# EAGLE design Haar (EAGLE 9.2.1)
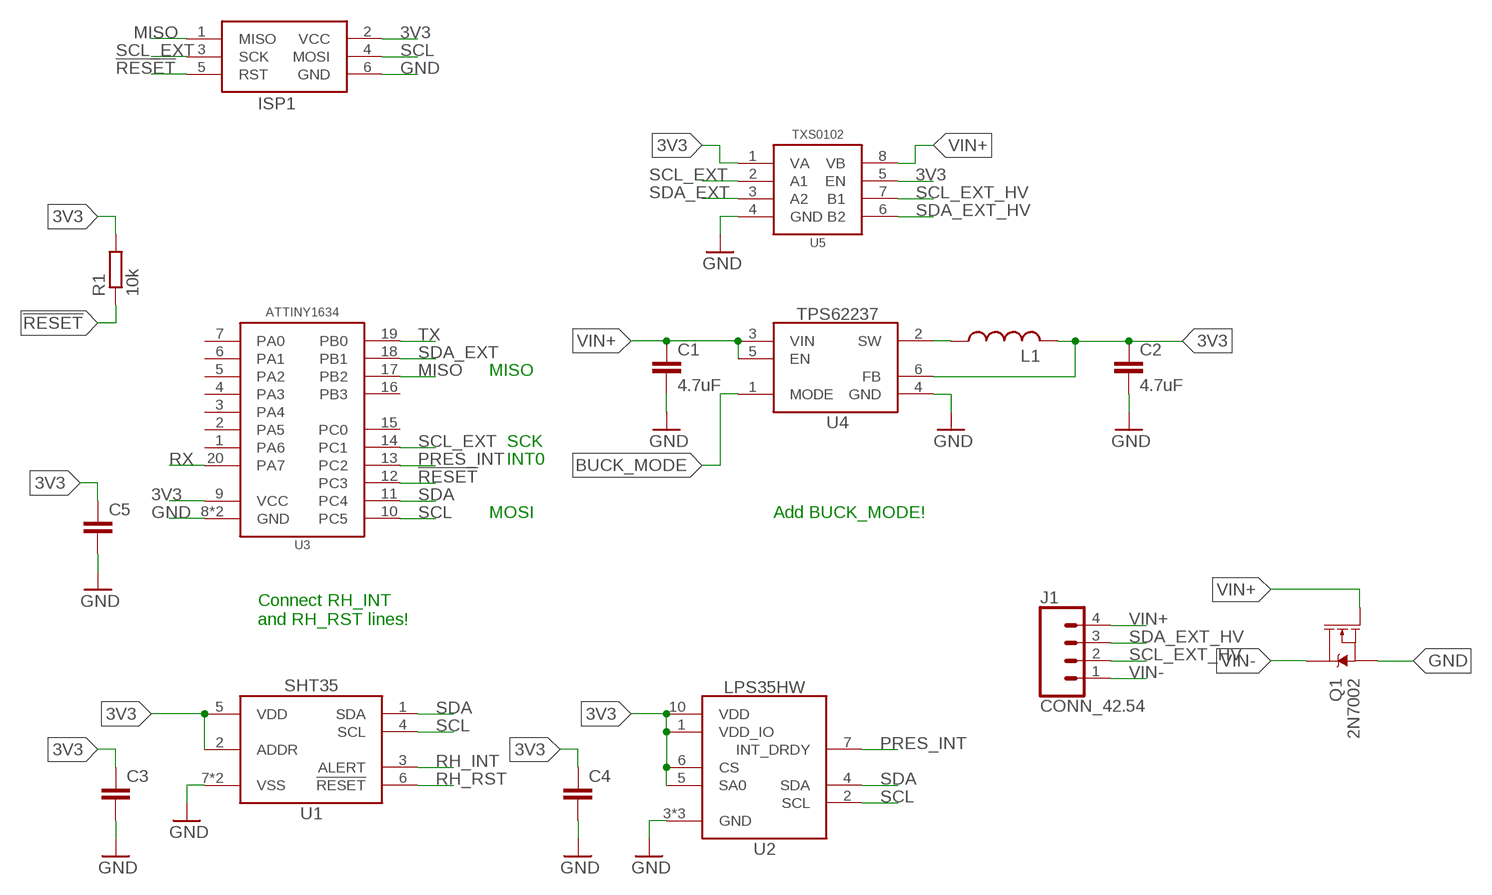
[diagram p0: schematic, sheet 1]

## Parts
C1  4.7uF  C-EUC0402  [C0402]
C2  4.7uF  C-EUC0402  [C0402]
C3  C-EU0.1UFC0402  [C0402]
C4  C-EU0.1UFC0402  [C0402]
C5  C-EU0.1UFC0402  [C0402]
ISP1  AVRISP1.27MM  [2X3_1.27]
J1  CONN_42.54  [1X04]
L1  INDUCTOR0805  [0805]
Q1  2N7002  MOSFET-NCH-2N7002PW  [SOT323]
R1  10k  R-EU_10KR0402  [R0402]
U1  SHT35DFN  [DFN_8_2.5X2.5]
U2  LPS35HW  [CCLGA10L]
U3  ATTINY1634QFN  [QFN20]
U4  TPS62237DRY  [DRY0006A]
U5  TXS0102DQM  [DQM_R-PX2SON-N8]

## Nets
3V3: C2.1 C3.1 C4.1 C5.1 ISP1.2(VCC) L1.2 R1.2 U1.2(ADDR) U1.5(VDD) U2.1(VDD_IO) U2.5(SA0) U2.6(CS) U2.10(VDD) U3.9(VCC) U4.6(FB) U5.1(VA) U5.5(EN)
!RESET: ISP1.5(RST) R1.1 U3.12(PC3)
BUCK_MODE: U4.1(MODE)
GND: C1.2 C2.2 C3.2 C4.2 C5.2 ISP1.6(GND) Q1.2(S) U1.7(VSS) U1.8(VSS) U2.3(GND) U2.8(GND) U2.9(GND) U3.8(GND) U3.EP(GND) U4.4(GND) U5.4(GND)
MISO: ISP1.1(MISO) U3.17(PB2)
N$1: L1.1 U4.2(SW)
PRES_INT: U2.7(INT_DRDY) U3.13(PC2)
RH_INT: U1.3(ALERT)
RH_RST: U1.6(!RESET)
RX: U3.20(PA7)
SCL: ISP1.4(MOSI) U1.4(SCL) U2.2(SCL) U3.10(PC5)
SCL_EXT: ISP1.3(SCK) U3.14(PC1) U5.2(A1)
SCL_EXT_HV: J1.2 U5.7(B1)
SDA: U1.1(SDA) U2.4(SDA) U3.11(PC4)
SDA_EXT: U3.18(PB1) U5.3(A2)
SDA_EXT_HV: J1.3 U5.6(B2)
TX: U3.19(PB0)
VIN+: C1.1 J1.4 Q1.1(G) U4.3(VIN) U4.5(EN) U5.8(VB)
VIN-: J1.1 Q1.3(D)
Unconnected: U3.1(PA6) U3.2(PA5) U3.3(PA4) U3.4(PA3) U3.5(PA2) U3.6(PA1) U3.7(PA0) U3.15(PC0) U3.16(PB3)

## Notes on the sheet
- MISO
- SCK
- INT0
- MOSI | Add BUCK_MODE!
- Connect RH_INT 
  and RH_RST lines!

## Library data of the parts
C1 C2 = bschulz_passives:C-EU: CAPACITOR, European symbol
C3-C5 = bschulz_passives:C-EU: CAPACITOR, European symbol; DIGIKEY: 490-4759-1-ND; MF: Murata; MPN: GCM155R71C104KA55D
ISP1 = bschulz:AVRISP: AVR ISP HEADER Standard 6 pin header for AVR programming
J1 = bschulz:CONN_4: Genaric 4 terminal header Digikey 2.54_SCREW <https://www.digikey.com/product-detail/en/on-shore-technology-inc/OSTVN04A150/ED10563-ND/1588864>
L1 = bschulz:INDUCTOR: Genaric inductor
Q1 = bschulz:MOSFET-NCH: N-channel MOSFETs Voltage controlled devices that allow control of high current outputs. SparkFun Products: SparkFun OpenScale <https://www.sparkfun.com/products/13261> SparkFun Digital Sandbox <https://www.sparkfun.com/products/12651> SparkFun Monster Moto Shield <https://www.sparkfun.com/products/10182> SparkFun MOSFET Power Controller <https://www.sparkfun.com/products/11214>; DIGIKEY: 2N7002W-FDICT-ND; MF: Diodes Incorporated; MPN: 2N7002W-7-F; PROD_ID: TRANS-11151
R1 = bschulz_passives:R-EU_: RESISTOR, European symbol Digikey Parts: Yageo, 0402 <https://www.digikey.com/products/en/resistors/chip-resistor-surface-mount/52?k=&pkeyword=&sf=0&FV=ffec1104%2Cfffc000d%2C1c0002%2C440067%2C1f140000%2Cffe00034%2C400004&quantity=&ColumnSort=0&page=1&stock=1&pageSize=25> Yageo, 0603 <https://www.digikey.com/products/en/resistors/chip-resistor-surface-mount/52?k=&pkeyword=&s=4356&s=47360&sf=0&FV=fffc000d%2C1c0002%2C142c040c%2C1f140000%2Cffe00034&quantity=10&ColumnSort=1000011&page=1&stock=1&pageSize=25> Panasonic, 0603 <https://www.digikey.com/products/en/resistors/chip-resistor-surface-mount/52?k=&pkeyword=&pv252=68&sf=0&FV=ffec373d%2C1c0002%2C142c040c%2C1f140000%2Cffe00034%2C80002%2Cc0001&quantity=&ColumnSort=0&page=1&stock=1&pageSize=25> Panasonic, precision, 0603 <https://www.digikey.com/products/en/resistors/chip-resistor-surface-mount/52?FV=ffec4907%2Cfffc000a%2Cc0172%2C142c040c%2C1f140000%2Cffe00034%2C1c0002&quantity=100&ColumnSort=2085&page=1&stock=1&pageSize=25> Panasonic, 0805 <https://www.digikey.com/products/en/resistors/chip-resistor-surface-mount/52?k=&pkeyword=&pv3=1&sf=0&FV=ffec373d%2C1c0002%2C1f140000%2Cffe00034%2C142c040d&quantity=&ColumnSort=0&page=1&stock=1&pageSize=25> Rohm, current sense <https://www.digikey.com/products/en/resistors/chip-resistor-surface-mount/52?k=&pkeyword=&pv3=1&sf=0&FV=ffecb688%2C1f140000%2Cffe00034%2C1c0002&quantity=&ColumnSort=0&page=1&stock=1&pageSize=25> Vishay, pulse proof automotive <https://www.digikey.com/products/en/resistors/chip-resistor-surface-mount/52?k=&pkeyword=&pv7=2&sf=0&FV=ffec5d6b%2Cffe00034%2C1f140000&quantity=&ColumnSort=0&page=1&stock=1&pageSize=25>; DIGIKEY: 311-10KJRCT-ND; MF: Yageo; MPN: RC0402JR-0710KL; VALUE_PART: 10k
U1 = bschulz:SHT3*: SHT3x - Digital Humidity and Temperature Sensor Characteristics (for SHT35): Vcc: 2.15V ~ 5.5V Humidity Resolution: 0.01% RH Humidity Accuracy: ±1.5% RH Temperature Resolution: 0.01°C Temperature Accuracy: 0.1°C Operating Temperature: -40°C to 125°C Digikey: 1649-1065-1-ND (SHT30) <https://www.digikey.com/product-detail/en/sensirion-ag/SHT30-DIS-F2.5KS/1649-1065-1-ND/6212136> 1649-1066-1-ND (SHT31) <https://www.digikey.com/product-detail/en/sensirion-ag/SHT31-DIS-F2.5KS/1649-1066-1-ND/6212137> 1649-1067-1-ND (SHT35) <https://www.digikey.com/product-detail/en/sensirion-ag/SHT35-DIS-F2.5KS/1649-1067-1-ND/6212138>; DIGIKEY: 1649-1067-1-ND; DISP: SHT35; MF: Sensirion; MPN: SHT35-DIS-F2.5KS
U2 = bschulz:LPS3*HW: LPS3xHW - Digital Water Resistant Pressure Sensor Characteristics: Vcc: 1.7V ~ 3.6V Pressure Range: 260 ~ 1260 mBar Pressure Resolution: 0.24 μBar Pressure Accuracy: relative ±0.1 mBar, abs ± 1 mBar Temperature Resolution: 0.01°C Temperature Accuracy: 1.5°C Operating Temperature: -40°C to 125°C Digikey: 497-16706-1-ND (LPS35HW) <https://www.digikey.com/product-detail/en/stmicroelectronics/LPS35HWTR/497-16706-1-ND/6192808> 497-17590-1-ND (LPS33HW) <https://www.digikey.com/product-detail/en/stmicroelectronics/LPS33HWTR/497-17590-1-ND/7565514>; DIGIKEY: 497-16706-1-ND; DISP: LPS35HW; MF: ST; MPN: LPS35HWTR
U3 = bschulz:ATTINY1634: ATtiny1634 8 bit AVR Microcontroller Features: Vcc: 1.8 ~ 5.5V Clock: Up to 16MHz, Internal 8MHz FRC, 32kHz RC Flash Memory: 16K SRAM: 1K EEPROM: 256B ADC: 10b, 12 port USART: Yes, x2 SPI: Yes I2C: Yes, slave only Notes: 2 analog comp. Digikey: ATTINY1634R-MURCT-ND (QFN) <https://www.digikey.com/product-detail/en/microchip-technology/ATTINY1634R-MUR/ATTINY1634R-MURCT-ND/3440781> ATTINY1634R-SU-ND (SOIC) <https://www.digikey.com/product-detail/en/ATTINY1634R-SU/ATTINY1634R-SU-ND/3128699/?itemSeq=272981030>; DIGIKEY: ATTINY1634-MURCT-ND; MF: Atmel; MPN: ATTINY1634-MUR
U4 = bschulz:TPS6223*: TPS6223xx - Ultra Small Step Down Converter (Buck) Characteristics: Vin: 2.05V ~ 6V Vout: 1V ~ 3.3V (fixed increments) IQ: 22μA Output Current: 500 mA Operating Temperature: -40°C to 85°C Digikey: TPS62237 (3.3V Fixed) <https://www.digikey.com/product-detail/en/texas-instruments/TPS62237DRYR/296-39454-1-ND/5143402>; DIGIKEY: 296-39454-1-ND; DISP: TPS62237; MF: TI; MPN: TPS62237DRYR
U5 = bschulz:TXS0102: TXS0102 - 2 Channel Bidirectional Voltage Level Translator Characteristics: Vcc: 1.65 ~ 3.6V (Port A), 2.3 ~ 5.5V (Port B) IQ: 14.4μA Output Current: 50mA Output Type: Open Drain/Push-Pull Operating Temperature: -40°C to 85°C Digikey: 296-28368-1-ND (DQE) <https://www.digikey.com/product-detail/en/texas-instruments/TXS0102DQER/296-28368-1-ND/2625893> 296-28435-1-ND (DQM) <https://www.digikey.com/product-detail/en/texas-instruments/TXS0102DQMR/296-28435-1-ND/2638910> 296-21931-1-ND (DCU) <https://www.digikey.com/product-detail/en/texas-instruments/TXS0102DCUR/296-21931-1-ND/1629284>; DIGIKEY: 296-28435-1-ND; MF: TI; MPN: TXS0102DQMR

## Board
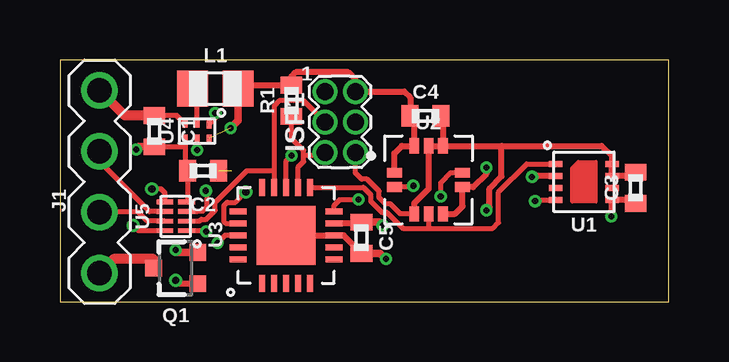
[diagram p1: board, top side]
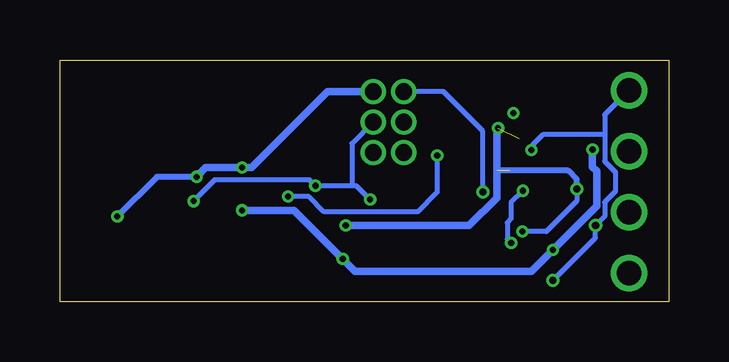
[diagram p2: board, bottom side, seen from below]

Size 25.38 x 10.08 mm. Coordinates in mm from the lower left corner, seen from the top.
Outline: 0,0 25.38,0 25.38,10.08 0,10.08 0,0
Copper layers (1*16): Top 0.035559375mm / dielectric 1.6mm / Bottom 0.035559375mm
Design rules "oshpark-2layer": minimum track width 6mil, minimum drill 10mil, track to track 6mil, track to pad 6mil, pad to pad 6mil, via to via 6mil, smd to smd 6mil, copper to edge 15mil, drill to drill 6mil, minimum pad ring 5mil, minimum via ring 5mil, stop-mask expansion 2.5mil, vias tented up to drill 0mil, thermal gap 10mil

### Footprints (pad centres in the part's own frame; a part is rotated, then mirrored left to right if it is on the bottom)
C0402 = smd 0.7 x 0.9: 1 -0.65,0; 2 0.65,0
2X3_1.27 = drill 0.7 pad 1.05: 1 -1.27,-0.635; 2 -1.27,0.635; 3 0,-0.635; 4 0,0.635; 5 1.27,-0.635; 6 1.27,0.635
1X04 = drill 1.016: 1 -3.81,0; 2 -1.27,0; 3 1.27,0; 4 3.81,0
0805 = smd 1.3 x 1.5: 1 -0.95,0; 2 0.95,0
SOT323 = smd 0.7 x 0.7: 1 -0.65,-0.925; 2 0.65,-0.925; 3 0,0.925
R0402 = smd 0.7 x 0.9: 1 -0.65,0; 2 0.65,0
DFN_8_2.5X2.5 = smd 0.55 x 0.25: 1 -1.175,0.75; 2 -1.175,0.25; 3 -1.175,-0.25; 4 -1.175,-0.75; 5 1.175,-0.75; 6 1.175,-0.25; 7 1.175,0.25; 8 1.175,0.75
CCLGA10L = smd 0.63 x 0.4: 1 -1.42,0.3; 2 -1.42,-0.3; 6 1.42,-0.3; 7 1.42,0.3 | smd 0.4 x 0.63: 3 -0.6,-1.42; 4 0,-1.42; 5 0.6,-1.42; 8 0.6,1.42; 9 0,1.42; 10 -0.6,1.42
QFN20 = smd 0.7 x 0.25: 1 -2.032,0.968; 2 -2.032,0.468; 3 -2.032,-0.032; 4 -2.032,-0.532; 5 -2.032,-1.032; 11 1.968,-1.032; 12 1.968,-0.532; 13 1.968,-0.032; 14 1.968,0.468; 15 1.968,0.968 | smd 0.25 x 0.7: 6 -1.032,-2.032; 7 -0.532,-2.032; 8 -0.032,-2.032; 9 0.468,-2.032; 10 0.968,-2.032; 16 0.968,1.968; 17 0.468,1.968; 18 -0.032,1.968; 19 -0.532,1.968; 20 -1.032,1.968 | smd 2.45 x 2.45: EP -0.032,-0.032
DRY0006A = smd 0.35 x 0.2: 1 -0.275,0.5 | smd 0.3 x 0.2: 2 -0.3,0; 3 -0.3,-0.5; 4 0.3,-0.5; 5 0.3,0; 6 0.3,0.5
DQM_R-PX2SON-N8 = smd 0.2 x 0.7: 1 -0.6,-0.45; 2 -0.2,-0.45; 3 0.2,-0.45; 4 0.6,-0.45; 5 0.6,0.45; 6 0.2,0.45; 7 -0.2,0.45; 8 -0.6,0.45

### Placement (x,y rotation side)
C1  3.94,7.11 270 top
C2  5.97,5.46 180 top
C3  24,4.75 90 top
C4  15.24,7.75 0 top
C5  12.57,2.67 270 top
ISP1  11.68,7.49 270 top
J1  1.65,5 90 top
L1  6.48,8.89 0 top
Q1  4.83,1.4 90 top
R1  9.65,8.38 90 top
U1  21.84,5 0 top
U2  15.37,5.08 0 top
U3  9.4,2.79 90 top
U4  5.71,7.11 270 top
U5  4.83,3.56 90 top

### Tracks (layer width: path | path; a pad name or v marks a point on that pad's centre or on a via)
3V3  (via drill 0.25, 0.3)  (2 unrouted)
  Top 0.2: U5.5 4.38,4.54 4.21,4.7 v3.83,4.7 | 5.5,2.96 U5.1 6.06,2.96 v6.1,2.92
  Top 0.254: U2.5 16.48,3.66 16.79,3.97 U2.6 17.23,4.78 17.78,5.33 v17.78,5.59 | U2.1 13.95,6.19 14.26,6.5 U2.10 14.77,7.57 14.61,7.73 | C4.1 14.61,7.73 | 14.61,7.73 14.61,8.51 14.35,8.76 ISP1.2 12.32,9.27 12.02,9.57 9.83,9.57 9.65,9.39 R1.2 7.57,9.03 L1.2 | U1.2 19.73,5.25 v19.68,5.21 | C3.1 23.85,4.25 U1.5 23.02,3.59 v22.99,3.56 | C5.1 12.52,3.26 U3.9
  Top 0.305: L1.2 7.43,7.55 v7.11,7.24 | v13.46,3.17 13.32,3.32 C5.1
  Bottom 0.2: v3.83,4.7 3.83,4.19 5.1,2.92 v6.1,2.92
  Bottom 0.254: v19.68,5.21 21.34,5.21 v22.99,3.56 | v17.78,5.59 | v3.83,4.7 3.83,5.1 4.19,5.46 7.17,5.46
  Bottom 0.305: ISP1.2 14.22,8.76 17.4,5.59 v17.78,5.59 19.3,5.59 v19.68,5.21 | v7.11,7.24 7.17,7.19 7.17,5.46 7.17,4.33 8.32,3.17 v13.46,3.17
!RESET
  Top 0.2: 10.16,6.1 10.16,5.84 9.93,5.61 U3.12 | 10.16,6.1 10.16,6.3 9.65,6.81 R1.1 | ISP1.5 10.92,6.1 10.16,6.1
BUCK_MODE  (via drill 0.25)
  Top 0.2: U4.1 6.48,7.65 v6.48,7.87
GND  (via drill 0.25)
  Top 0.2: U2.3 14.19,3.66 13.78,4.07 13.57,4.07 13.31,4.34 13.31,4.61 12.8,5.11 12.57,5.11 12.32,5.37 ISP1.6 | U4.4 5.21,6.48 | 5.21,6.48 5.21,5.57 C2.2 5.32,4.2 U5.4 | C1.2 5.2,6.46 5.21,6.48
  Top 0.254: U2.8 U2.9 15.37,4.7 14.77,4.1 U2.3 | C4.2 15.97,7.67 U2.8 | C3.2 23.86,5.25 U1.7 U1.8 23.02,6.06 22.58,6.5 18.41,6.5 | U2.8 18.41,6.5 | C5.2 11.83,2.76 U3.8 U3.EP | v17.78,3.81 17.91,3.94 17.91,4.73 18.41,5.24 18.41,6.5
  Top 0.305: v3.17,6.35 3.28,6.46 C1.2 | v13.59,1.78 13.35,2.02 C5.2 | Q1.2 4.94,2.05 v4.83,2.16
  Bottom 0.305: v3.17,6.35 3.17,5.62 3,5.45 3,3.99 v4.83,2.16 5.71,1.27 13.08,1.27 v13.59,1.78 15.62,3.81 v17.78,3.81
MISO  (via drill 0.3)
  Top 0.2: v7.75,4.57 7.31,4.14 6.97,4.14 6.83,3.99 6.83,3.33 6.9,3.26 U3.17
  Bottom 0.2: v7.75,4.57 7.75,7.11 9.4,8.76 ISP1.1
N$1
  Top 0.2: U4.2 5.71,8.7 L1.1
PRES_INT  (via drill 0.25)
  Top 0.2: U3.13 9.43,5.87 v9.65,6.1 | v15.88,4.38 15.88,4.95 16.3,5.38 U2.7
  Bottom 0.2: v15.88,4.38 15,4.38 14.36,3.75 10.46,3.75 9.65,4.55 v9.65,6.1
SCL  (via drill 0.25)
  Top 0.2: U3.10 11.43,4.02 11.67,4.26 v12.45,4.26 | v14.73,4.83 14.68,4.78 U2.2 | v19.81,4.19 19.87,4.25 U1.4
  Bottom 0.2: v12.45,4.26 13.02,4.83 13.21,4.83 | 13.21,4.83 v14.73,4.83 14.99,5.09 18.91,5.09 v19.81,4.19 | ISP1.4 13.21,6.6 13.21,4.83
SCL_EXT
  Top 0.2: ISP1.3 10.16,8.38 9.14,8.38 8.93,8.17 8.93,5.46 | 8.93,5.46 U3.14 | U5.2 5.81,3.36 5.89,3.43 6.1,3.43 6.47,3.81 6.47,4.14 7.8,5.46 8.93,5.46
SCL_EXT_HV
  Top 0.2: U5.7 3.64,3.36 3.27,3.73 J1.2
SDA
  Top 0.2: U1.1 19.47,5.75 18.29,4.57 18.29,3.3 18.04,3.06 15.37,3.06 | U2.4 15.37,3.06 | U3.11 12.66,4.76 12.95,4.46 12.95,4.32 12.95,4.19 13.42,3.72 13.63,3.72 14.3,3.06 15.37,3.06
SDA_EXT  (via drill 0.25)
  Top 0.2: U3.18 6.88,2.76 v6.57,2.45 | 5.34,3.76 U5.3 5.71,3.76 5.74,3.78 5.95,3.78 6.12,3.95 6.12,4.58 v6.08,4.62
  Bottom 0.2: v6.08,4.62 6.57,4.14 6.57,3.46 6.73,3.3 6.73,2.61 v6.57,2.45
SDA_EXT_HV
  Top 0.2: 4.17,3.76 U5.6 3.74,3.76 1.65,5.84 J1.3
VIN+  (via drill 0.25, 0.3)
  Top 0.2: U5.8 3.27,2.96 v3.05,3.17 | U4.3 4.87,7.76 C1.1 | U4.5 v5.72,6.32
  Top 0.254: Q1.1 4.97,0.75 v4.83,0.89
  Top 0.406: C1.1 2.7,7.76 J1.4
  Bottom 0.2: v4.83,0.89 3.05,2.67 v3.05,3.17 2.67,3.56 2.67,4.15 2.22,4.6 2.22,5.4 2.67,5.85 2.67,6.99 | J1.4 2.67,7.8 2.67,6.99 | 2.67,6.99 5.22,6.99 5.72,6.48 v5.72,6.32
VIN-
  Top 0.406: 3.9,1.78 2.24,1.78 J1.1